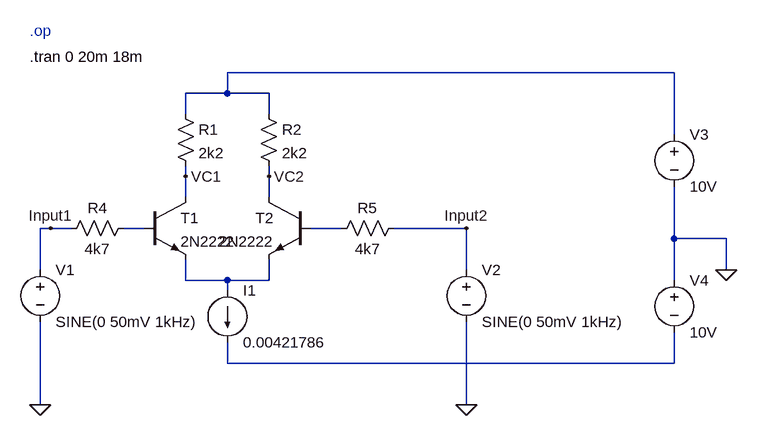
[diagram p0: schematic p1 2.asc]
p1 2.asc, the LTspice schematic file:
Version 4
SHEET 1 960 680
WIRE 864 80 176 80
WIRE 176 112 176 80
WIRE 176 112 112 112
WIRE 240 112 176 112
WIRE 112 144 112 112
WIRE 240 144 240 112
WIRE 864 176 864 80
WIRE 112 240 112 224
WIRE 240 240 240 224
WIRE 112 272 112 240
WIRE 240 272 240 240
WIRE -96 320 -112 320
WIRE -64 320 -96 320
WIRE 48 320 16 320
WIRE 352 320 304 320
WIRE 544 320 432 320
WIRE 864 336 864 256
WIRE 944 336 864 336
WIRE -112 384 -112 320
WIRE 544 384 544 320
WIRE 944 384 944 336
WIRE 112 400 112 368
WIRE 176 400 112 400
WIRE 240 400 240 368
WIRE 240 400 176 400
WIRE 864 400 864 336
WIRE 176 416 176 400
WIRE 176 528 176 496
WIRE 864 528 864 480
WIRE 864 528 176 528
WIRE -112 592 -112 464
WIRE 544 592 544 464
FLAG 944 384 0
FLAG -112 592 0
FLAG 544 592 0
FLAG 112 240 VC1
FLAG 240 240 VC2
FLAG -96 320 Input1
FLAG 544 320 Input2
SYMBOL Voltage 864 384 R0
SYMATTR InstName V4
SYMATTR Value 10V
SYMBOL Voltage 864 160 R0
SYMATTR InstName V3
SYMATTR Value 10V
SYMBOL Res 224 128 R0
SYMATTR InstName R2
SYMATTR Value 2k2
SYMBOL Res 96 128 R0
SYMATTR InstName R1
SYMATTR Value 2k2
SYMBOL npn 48 272 R0
SYMATTR InstName T1
SYMATTR Value 2N2222
SYMBOL npn 304 272 M0
SYMATTR InstName T2
SYMATTR Value 2N2222
SYMBOL Res 32 304 R90
WINDOW 0 0 56 VBottom 2
WINDOW 3 32 56 VTop 2
SYMATTR InstName R4
SYMATTR Value 4k7
SYMBOL Voltage -112 368 R0
SYMATTR InstName V1
SYMATTR Value SINE(0 50mV 1kHz)
SYMBOL Res 448 304 R90
WINDOW 0 0 56 VBottom 2
WINDOW 3 32 56 VTop 2
SYMATTR InstName R5
SYMATTR Value 4k7
SYMBOL Voltage 544 368 R0
SYMATTR InstName V2
SYMATTR Value SINE(0 50mV 1kHz)
SYMBOL current 176 416 R0
SYMATTR InstName I1
SYMATTR Value 0.00421786
TEXT -128 16 Left 2 ;.op
TEXT -128 56 Left 2 !.tran 0 20m 18m

The netlist it stands for:
* p1 2.asc
V4 0 N005 10V
V3 N001 0 10V
R2 N001 VC2 2k2
R1 N001 VC1 2k2
Q§T1 VC1 N002 N004 0 2N2222
Q§T2 VC2 N003 N004 0 2N2222
R4 N002 Input1 4k7
V1 Input1 0 SINE(0 50mV 1kHz)
R5 Input2 N003 4k7
V2 Input2 0 SINE(0 50mV 1kHz)
I1 N004 N005 0.00421786
.model NPN NPN
.model PNP PNP
.lib standard.bjt
* .op
.tran 0 20m 18m
.backanno
.end